# Altium project RF Oscillator - R2.PrjPcb
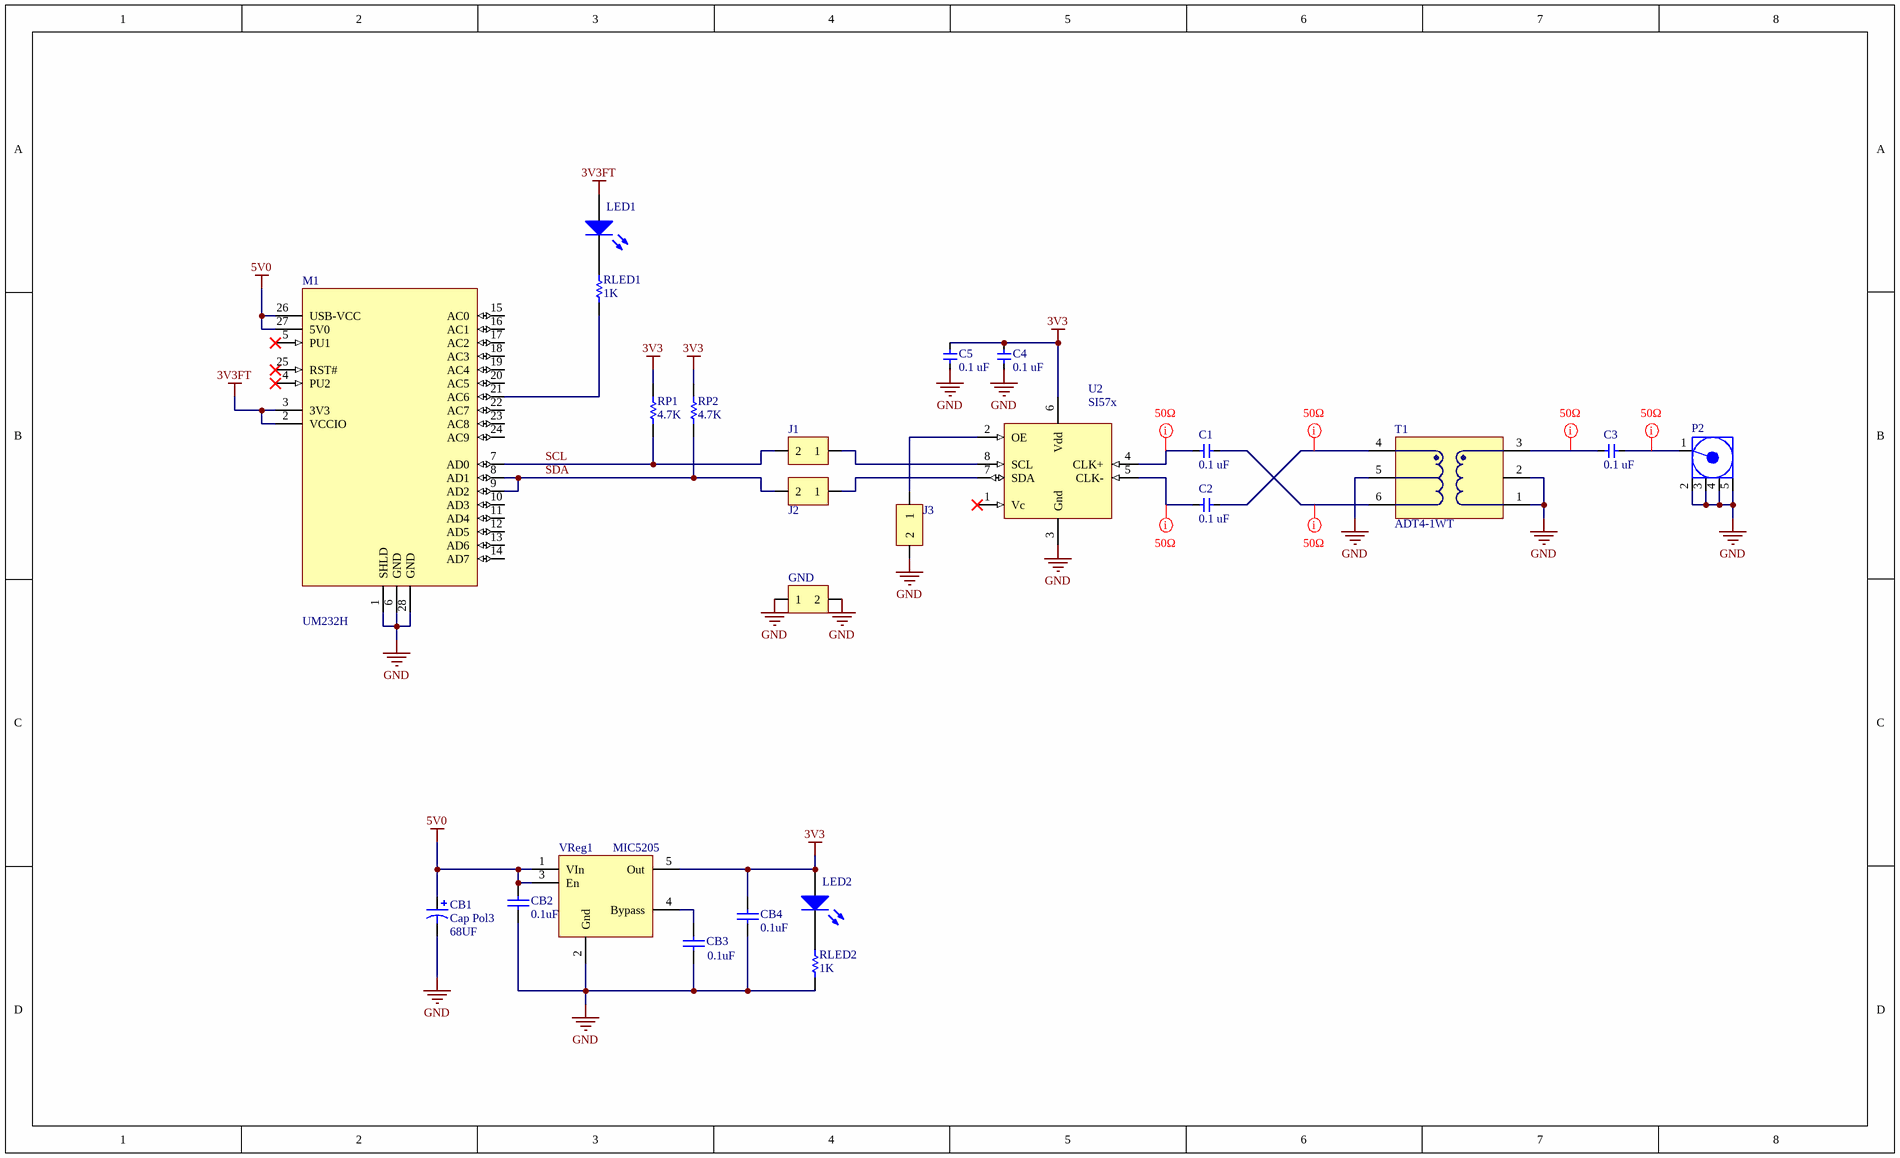
[diagram p0: Main.SchDoc]
1 sheet, 24 parts. Net scope: global (net labels, ports and power ports of the same name join across sheets).
Board file: Main.PcbDoc

## Sheet Main.SchDoc
size Legal

### Parts
C1  value 0.1 uF  [0603C]  (hidden comment: SMT Cap)
C2  value 0.1 uF  [0603C]  (hidden comment: SMT Cap)
C3  value 0.1 uF  [0603C]  (hidden comment: SMT Cap)
C4  value 0.1 uF  [0603C]  (hidden comment: SMT Cap)
C5  value 0.1 uF  [0603C]  (hidden comment: SMT Cap)
CB1  Cap Pol3  value 68UF  [V]
CB2  value 0.1uF  [0603C]  (hidden comment: Cap Semi)
CB3  value 0.1uF  [0603C]  (hidden comment: Cap Semi)
CB4  value 0.1uF  [0603C]  (hidden comment: Cap Semi)
GND  Jumper  [HDR1X2]  (value not drawn)
J1  Jumper  [HDR1X2]  (value not drawn)
J2  Jumper  [HDR1X2]  (value not drawn)
J3  Jumper  [HDR1X2]  (value not drawn)
LED1  LED2  [Chip LED 3220]  (value not drawn)
LED2  LED2  [Chip LED 3220]  (value not drawn)
M1  UM232H  [UM232H Module]
P2  COAX-M  [SMA Jack - PCB Edge - MultiSize]  (value not drawn)
RLED1  value 1K  [1206R]  (hidden comment: Res Semi)
RLED2  value 1K  [1206R]  (hidden comment: Res Semi)
RP1  value 4.7K  [1206R]  (hidden comment: Res Semi)
RP2  value 4.7K  [1206R]  (hidden comment: Res Semi)
T1  ADT4-1WT  [CD542]
U2  SI57x  [SI57x]
VReg1  MIC5205  [SOT23-5AN]

### Nets
3V3: C4.2 C5.2 CB4.2 LED2.1(A) RP1.2 RP2.2 U2.6(Vdd) VReg1.5(Out)
3V3FT: LED1.1(A) M1.2(VCCIO) M1.3(3V3)
5V0: CB1.1 CB2.2 M1.26(USB-VCC) M1.27(5V0) VReg1.1(VIn) VReg1.3(En)
GND: C4.1 C5.1 CB1.2 CB2.1 CB3.1 CB4.1 GND.1 GND.2 J3.2 M1.1(SHLD) M1.6(GND) M1.28(GND) P2.2(GND) P2.3(GND) P2.4(GND) P2.5(GND) RLED2.1 T1.1(Input) T1.2(Gnd) T1.5(Termination) U2.3(Gnd) VReg1.2(Gnd)
SCL: J1.2 M1.7(AD0) RP1.1
SDA: J2.2 M1.8(AD1) M1.9(AD2) RP2.1
NetC1_1: C1.1 U2.4(CLK+)
NetC1_2: C1.2 T1.6(Output)
NetC2_1: C2.1 U2.5(CLK-)
NetC2_2: C2.2 T1.4(Termination)
NetC3_1: C3.1 T1.3(Coupled)
NetC3_2: C3.2 P2.1(Signal)
NetCB3_2: CB3.2 VReg1.4(Bypass)
NetJ1_1: J1.1 U2.8(SCL)
NetJ2_1: J2.1 U2.7(SDA)
NetJ3_1: J3.1 U2.2(OE)
NetLED1_2: LED1.2(K) RLED1.2
NetLED2_2: LED2.2(K) RLED2.2
NetM1_21: M1.21(AC6) RLED1.1

Not connected (* = marked no-connect by the designer): M1 4(PU2)* 5(PU1)* 10(AD3) 11(AD4) 12(AD5) 13(AD6) 14(AD7) 15(AC0) 16(AC1) 17(AC2) 18(AC3) 19(AC4) 20(AC5) 22(AC7) 23(AC8) 24(AC9) 25(RST#)*; U2 1(Vc)*

### Layout directives
rule Width Constraint [Pref Impedance = 50.00ohms    Min Impedance = 45.00ohms    Max Impedance = 70.00ohms]: NetC1_1, NetC1_2, NetC2_1, NetC2_2, NetC3_1, NetC3_2

### Library data of the parts
C1-C5 = Cap - SMT Small: Published: 8-Jun-2000; LatestRevisionDate: 29-May-2009; LatestRevisionNote: IPC-7351 Footprint Added.; PackageReference: C1206; Publisher: Altium Limited; PackageDescription: Chip Capacitor
CB1 = Cap Pol3: KEMET T520 KO-CAP  Polymer SMT Tantalum; DKPN: 399-3330-1-ND; Voltage: 10V; Type: KEMET T520 KO-CAP  Polymer SMT Tantalum
CB2-CB4 = Cap Semi: Capacitor (Semiconductor SIM Model); Published: 8-Jun-2000; LatestRevisionDate: 17-Jul-2002; LatestRevisionNote: Re-released for DXP Platform.; PackageReference: C1206; Publisher: Altium Limited
GND J1-J3 = Jumper - 2 Pin: Jumper - 2-Pin; LatestRevisionDate: 17-Jul-2002; LatestRevisionNote: Re-released for DXP Platform.; Publisher: Altium Limited
LED1 LED2 = LED2: Typical RED, GREEN, YELLOW, AMBER GaAs LED; Published: 8-Jun-2000; LatestRevisionDate: 17-Jul-2002; LatestRevisionNote: Re-released for DXP Platform.; PackageDocument: Feb-2002; PackageReference: 3.2X1.6X1.1; Publisher: Altium Limited
M1 = UM232H: FTDI FT232H Dev Module
P2 = COAX-M: RF Coaxial PCB Connector, MMCX; Thru-Hole, Vertical Mount Plug,  50 Ohm Impedance; PackageDocument: Rev. A, 16-Jun-1997; PCB_Layout: Complies with manufacturer's recommendation.; DrillSize: Corresponds to nominal value.; Published: 15-Jul-2004; LatestRevisionDate: 15-Jul-2004; LatestRevisionNote: Component Replaced.; DatasheetDocument: 30-May-2003; PackageReference: 908-21103; Publisher: Altium Limited; ComponentLink1Description: Manufacturer Link; ComponentLink1URL: http://www.amphenolrf.com/
RLED1 RLED2 RP1 RP2 = Res Semi: Semiconductor Resistor; Published: 8-Jun-2000; LatestRevisionDate: 17-Jul-2002; LatestRevisionNote: Re-released for DXP Platform.; PackageReference: AXIAL-0.5; Publisher: Altium Limited
T1 = ADT4-1WT: Surface Mount RF Transformer
U2 = SI570: 10 MHZ TO 1.4 GHZ I2C PROGRAMMABLE XO/VCXO
VReg1 = MIC5205: 150mA Low-Noise LDO Regulator